# EAGLE design NodeUSB (EAGLE 4.16)
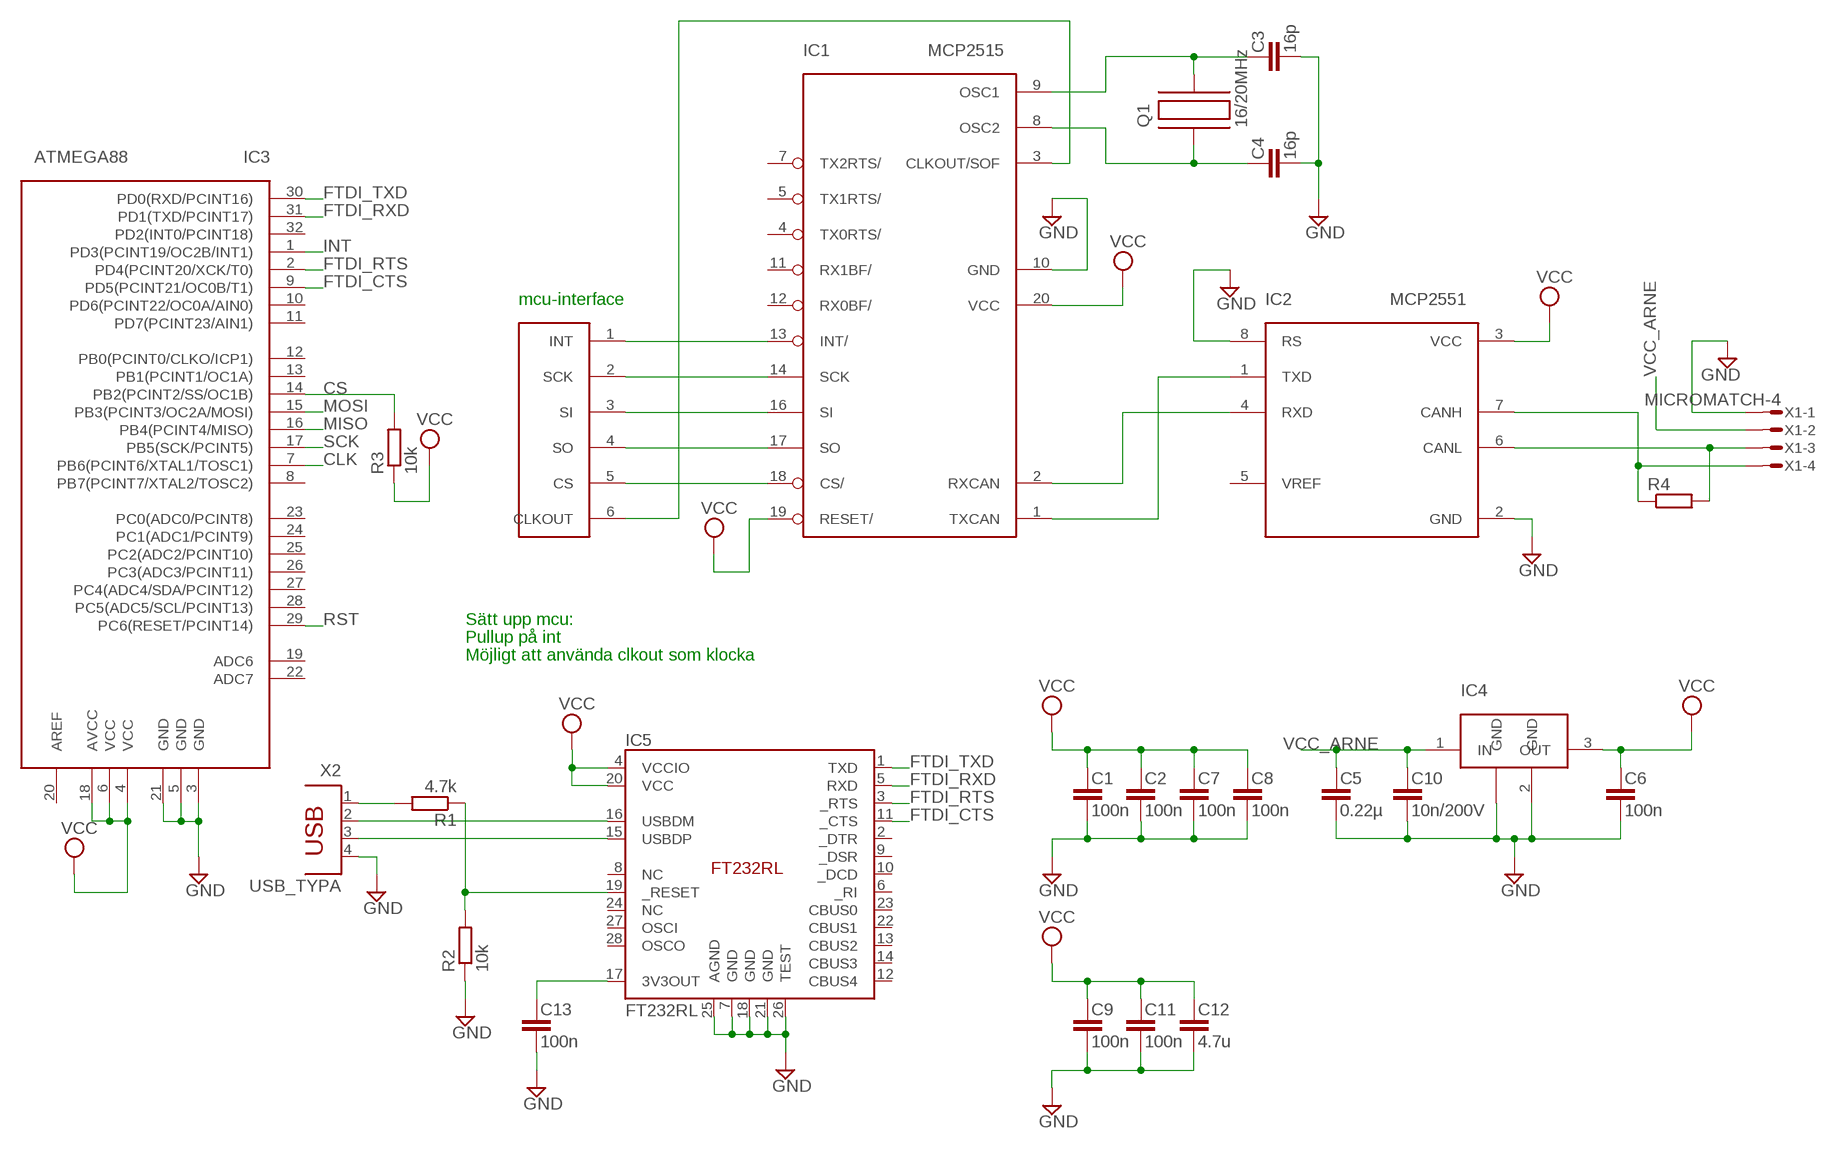
[diagram p0: schematic, sheet 1]

## Parts
C1  100n  C-EU  [C0603]
C2  100n  C-EU  [C0603]
C3  16p  C-EU  [C0603]
C4  16p  C-EU  [C0603]
C5  0.22µ  C-EU  [C0603]
C6  100n  C-EU  [C0603]
C7  100n  C-EU  [C0603]
C8  100n  C-EU  [C0603]
C9  100n  C-EU  [C0603]
C10  10n/200V  C-EU  [C0603]
C11  100n  C-EU  [C0603]
C12  4.7u  C-EU  [C0603]
C13  100n  C-EU  [C0603]
IC1  MCP2515  [TSSOP]
IC2  MCP2551  [SOIC]
IC3  ATMEGA88  [TQFP32]
IC4  LM340MP-5.0  [SOT223]
IC5  FT232RL  [SSOP-28]
Q1  16/20MHz  C-MAC-LFA147E  [SMD]
R1  4.7k  R-EUR0603  [R0603]
R2  10k  R-EUR0603  [R0603]
R3  10k  R-EUR0603  [R0603]
R4  R-EUR0603  [R0603]
U$1  CAN-INTERFACE  [VIA-LIST]
X1  MICROMATCH-4  [MICROMATCH-4]
X2  USB_TYPA  [LUMBERG_TYPA]

## Nets
CANH: IC2.7(CANH) R4.1 X1.4
CANL: IC2.6(CANL) R4.2 X1.3
CLK: IC1.3(CLKOUT/SOF) IC3.7(PB6(PCINT6/XTAL1/TOSC1)) U$1.6(CLKOUT)
CS: IC1.18(CS/) IC3.14(PB2(PCINT2/SS/OC1B)) R3.2 U$1.5(CS)
FTDI_CTS: IC3.9(PD5(PCINT21/OC0B/T1)) IC5.11(_CTS)
FTDI_RTS: IC3.2(PD4(PCINT20/XCK/T0)) IC5.3(_RTS)
FTDI_RXD: IC3.31(PD1(TXD/PCINT17)) IC5.5(RXD)
FTDI_TXD: IC3.30(PD0(RXD/PCINT16)) IC5.1(TXD)
GND: C1.2 C2.2 C3.2 C4.2 C5.2 C6.2 C7.2 C8.2 C9.2 C10.2 C11.2 C12.2 C13.2 IC1.10(GND) IC2.2(GND) IC2.8(RS) IC3.3(GND) IC3.5(GND) IC3.21(GND) IC4.2(GND) IC4.4(GND) IC5.7(GND) IC5.18(GND) IC5.21(GND) IC5.25(AGND) IC5.26(TEST) R2.1 X1.1 X2.4
INT: IC1.13(INT/) IC3.1(PD3(PCINT19/OC2B/INT1)) U$1.1(INT)
MISO: IC1.17(SO) IC3.16(PB4(PCINT4/MISO)) U$1.4(SO)
MOSI: IC1.16(SI) IC3.15(PB3(PCINT3/OC2A/MOSI)) U$1.3(SI)
N$1: IC1.2(RXCAN) IC2.4(RXD)
N$2: IC1.1(TXCAN) IC2.1(TXD)
N$7: C13.1 IC5.17(3V3OUT)
N$10: IC5.16(USBDM) X2.2
N$11: IC5.15(USBDP) X2.3
N$12: C3.1 IC1.9(OSC1) Q1.P$2
N$13: C4.1 IC1.8(OSC2) Q1.P$1
N$15: R1.2 X2.1
N$16: IC5.19(_RESET) R1.1 R2.2
RST: IC3.29(PC6(RESET/PCINT14))
SCK: IC1.14(SCK) IC3.17(PB5(SCK/PCINT5)) U$1.2(SCK)
VCC: C1.1 C2.1 C6.1 C7.1 C8.1 C9.1 C11.1 C12.1 IC1.19(RESET/) IC1.20(VCC) IC2.3(VCC) IC3.4(VCC) IC3.6(VCC) IC3.18(AVCC) IC4.3(OUT) IC5.4(VCCIO) IC5.20(VCC) R3.1
VCC_ARNE: C5.1 C10.1 IC4.1(IN) X1.2
Unconnected: IC1.4(TX0RTS/) IC1.5(TX1RTS/) IC1.7(TX2RTS/) IC1.11(RX1BF/) IC1.12(RX0BF/) IC2.5(VREF) IC3.8(PB7(PCINT7/XTAL2/TOSC2)) IC3.10(PD6(PCINT22/OC0A/AIN0)) IC3.11(PD7(PCINT23/AIN1)) IC3.12(PB0(PCINT0/CLKO/ICP1)) IC3.13(PB1(PCINT1/OC1A)) IC3.19(ADC6) IC3.20(AREF) IC3.22(ADC7) IC3.23(PC0(ADC0/PCINT8)) IC3.24(PC1(ADC1/PCINT9)) IC3.25(PC2(ADC2/PCINT10)) IC3.26(PC3(ADC3/PCINT11)) IC3.27(PC4(ADC4/SDA/PCINT12)) IC3.28(PC5(ADC5/SCL/PCINT13)) IC3.32(PD2(INT0/PCINT18)) IC5.2(_DTR) IC5.6(_RI) IC5.8(NC) IC5.9(_DSR) IC5.10(_DCD) IC5.12(CBUS4) IC5.13(CBUS2) IC5.14(CBUS3) IC5.22(CBUS1) IC5.23(CBUS0) IC5.24(NC) IC5.27(OSCI) IC5.28(OSCO)

## Notes on the sheet
- mcu-interface
- Sätt upp mcu:
- Pullup på int
- Möjligt att använda clkout som klocka

## Library data of the parts
C1-C13 = rcl:C-EU
IC1 = mcp2515:MCP2515
IC2 = mcp2551:MCP2551
IC3 = atmega88:ATMEGA88
IC4 = lm340mp:LM340MP-5.0
IC5 = ftdi4:FT232RL
Q1 = hc49-4h-smx:C-MAC-LFA147E
R1-R4 = rcl:R-EU
U$1 = can-interface:CAN-INTERFACE
X1 = con-amp-micromatch:MICROMATCH-4: MicroMaTch 4 7-215464-4 / 0-215464-4 Drawing Number C-215464 DDEController.pdf
X2 = usba:USB_TYPA

## Board
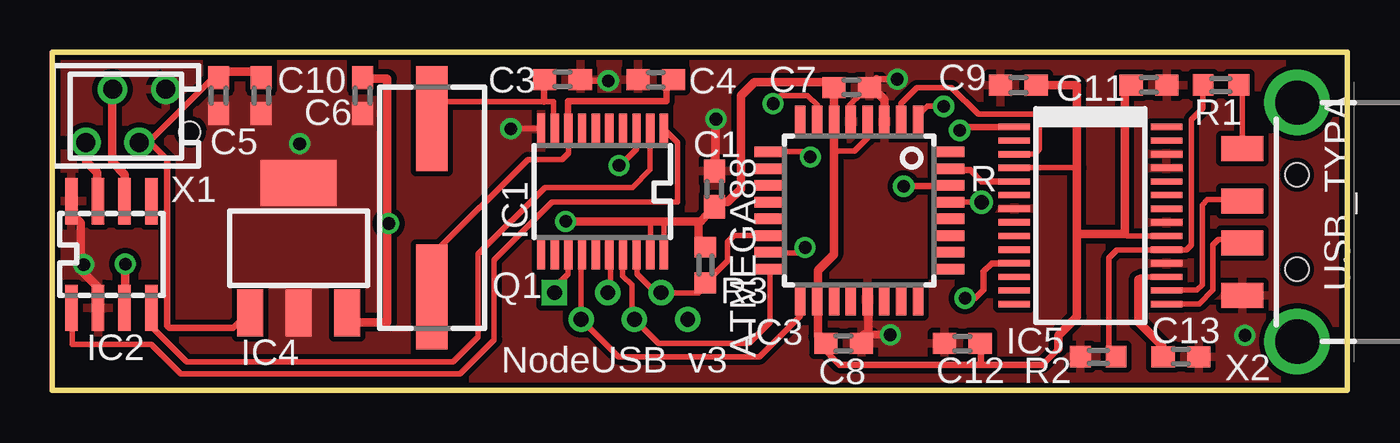
[diagram p1: board, top side]
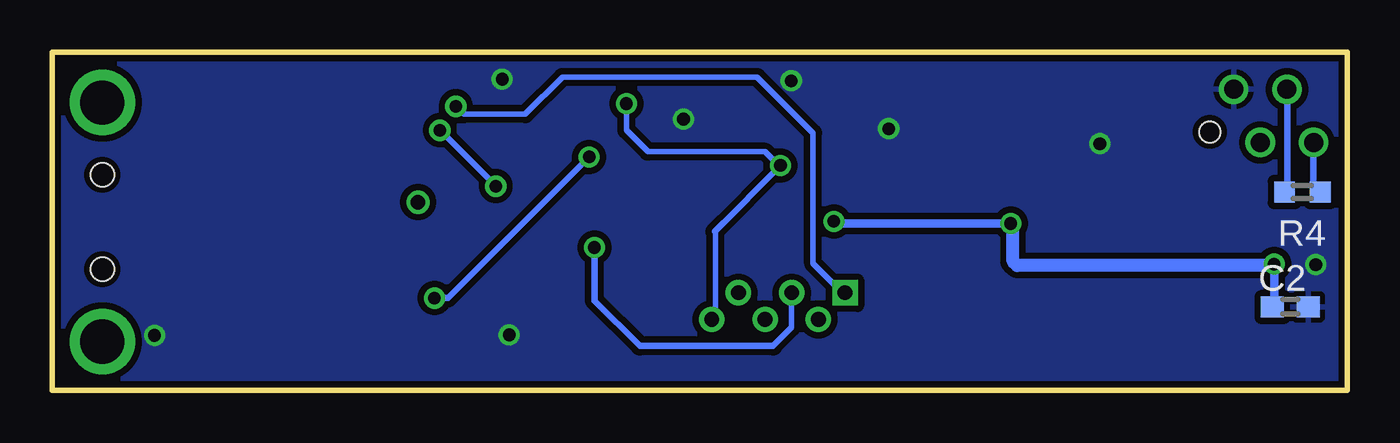
[diagram p2: board, bottom side, seen from below]

Size 61.68 x 16.11 mm. Coordinates in mm from the lower left corner, seen from the top.
Outline: 0,0 61.68,0 61.68,16.11 0,16.11 0,0
Copper layers (1*16): Top 0.035mm / dielectric 1.5mm / Bottom 0.035mm
Design rules "10mils, 0.6drill": minimum track width 10mil, minimum drill 0.6mm, track to track 10mil, track to pad 10mil, pad to pad 10mil, via to via 10mil, smd to smd 10mil, copper to edge 10mil, drill to drill 10mil, minimum pad ring 10mil, minimum via ring 8mil, stop-mask expansion 0mil, vias tented up to drill 0mil, thermal gap 10mil

### Footprints (pad centres in the part's own frame; a part is rotated, then mirrored left to right if it is on the bottom)
C0603 = smd 1.1 x 1: 1 -0.85,0; 2 0.85,0
TSSOP = smd 0.396 x 1.5: 1 -2.925,-2.975; 2 -2.275,-2.975; 3 -1.625,-2.975; 4 -0.975,-2.975; 5 -0.325,-2.975; 6 0.325,-2.975; 7 0.975,-2.975; 8 1.625,-2.975; 9 2.275,-2.975; 10 2.925,-2.975; 11 2.925,2.975; 12 2.275,2.975; 13 1.625,2.975; 14 0.975,2.975; 15 0.325,2.975; 16 -0.325,2.975; 17 -0.975,2.975; 18 -1.625,2.975; 19 -2.275,2.975; 20 -2.925,2.975
SOIC = smd 0.6 x 2.2: 1 -1.905,-2.54; 2 -0.635,-2.54; 3 0.635,-2.54; 4 1.905,-2.54; 5 1.905,2.54; 6 0.635,2.54; 7 -0.635,2.54; 8 -1.905,2.54
TQFP32 = smd 1.5 x 0.5: 1 -4.25,2.65; 2 -4.25,1.85; 3 -4.25,1.05; 4 -4.25,0.25; 5 -4.25,-0.55; 6 -4.25,-1.35; 7 -4.25,-2.15; 8 -4.25,-2.95; 17 4.25,-2.95; 18 4.25,-2.15; 19 4.25,-1.35; 20 4.25,-0.55; 21 4.25,0.25; 22 4.25,1.05; 23 4.25,1.85; 24 4.25,2.65 | smd 0.5 x 1.5: 9 -2.8,-4.4; 10 -2,-4.4; 11 -1.2,-4.4; 12 -0.4,-4.4; 13 0.4,-4.4; 14 1.2,-4.4; 15 2,-4.4; 16 2.8,-4.4; 25 2.8,4.1; 26 2,4.1; 27 1.2,4.1; 28 0.4,4.1; 29 -0.4,4.1; 30 -1.2,4.1; 31 -2,4.1; 32 -2.8,4.1
SOT223 = smd 1.219 x 2.235: 1 -2.311,-3.099; 2 0,-3.099; 3 2.311,-3.099 | smd 3.6 x 2.2: 4 0,3.099
SSOP-28 = smd 0.3 x 1.5: 1 -4.225,-3.625; 2 -3.575,-3.625; 3 -2.925,-3.625; 4 -2.275,-3.625; 5 -1.625,-3.625; 6 -0.975,-3.625; 7 -0.325,-3.625; 8 0.325,-3.625; 9 0.975,-3.625; 10 1.625,-3.625; 11 2.275,-3.625; 12 2.925,-3.625; 13 3.575,-3.625; 14 4.225,-3.625; 15 4.225,3.625; 16 3.575,3.625; 17 2.925,3.625; 18 2.275,3.625; 19 1.625,3.625; 20 0.975,3.625; 21 0.325,3.625; 22 -0.325,3.625; 23 -0.975,3.625; 24 -1.625,3.625; 25 -2.275,3.625; 26 -2.925,3.625; 27 -3.575,3.625; 28 -4.225,3.625
SMD = smd 5 x 1.5: P$1 4.25,0; P$2 -4.25,0
R0603 = smd 0.991 x 1.016: 1 -0.85,0; 2 0.85,0
VIA-LIST = drill 0.7 square: 1 0,2.54 | drill 0.7 round: 2 -1.27,1.27; 3 0,0; 4 -1.27,-1.27; 5 0,-2.54; 6 -1.27,-3.81
MICROMATCH-4 = drill 0.9 round: 1 1.905,1.27; 2 0.635,-1.27; 3 -0.635,1.27; 4 -1.905,-1.27 | hole 1: 3.048,-0.762
LUMBERG_TYPA = smd 1.2 x 2: 1 7,1; 2 4.5,1; 3 2.5,1; 4 0,1 | drill 2.1 round: TAB@1 -2.2,-1.6; TAB@2 9.2,-1.6 | hole 1.1: 1.25,-1.6; 5.75,-1.6

### Placement (x,y rotation side)
C1  31.54,9.6 90 top
C2  2.7,3.97 0 bottom
C3  24.3,14.81 0 top
C4  28.74,14.81 180 top
C5  7.92,14.05 270 top
C6  14.77,14.05 270 top
C7  38.08,14.44 0 top
C8  37.69,2.23 0 top
C9  46.02,14.55 180 top
C10  9.95,14.05 270 top
C11  52.24,14.55 0 top
C12  43.35,2.24 180 top
C13  53.76,1.6 0 top
IC1  26.21,9.48 180 top
IC2  2.8,6.47 0 top
IC3  38.59,8.57 270 top
IC4  11.73,6.78 0 top
IC5  49.45,8.33 270 top
Q1  18.08,8.71 270 top
R1  55.67,14.55 0 top
R2  49.83,1.6 0 top
R3  31.11,5.97 270 top
R4  2.12,9.45 180 bottom
U$1  26.46,4.65 90 top
X1  3.5,13.08 0 top
X2  57.7,4.52 90 top

### Tracks (layer width: path | path; a pad name or v marks a point on that pad's centre or on a via)
CANH
  Top 0.305: 2.12,9.06 IC2.7 | X1.4 1.62,11.81
  Top 0.406: 2.12,9.06 2.12,10.39 1.62,10.9 1.62,11.81
  Bottom 0.305: X1.4 1.62,11.81 1.62,9.79 R4.1
CANL
  Top 0.305: IC2.6 | X1.3 2.84,14.35
  Top 0.406: IC2.6 3.45,10.29 2.84,10.9 2.84,14.35
  Bottom 0.305: X1.3 2.84,14.35 2.84,9.59 R4.2
CLK  (via drill 0.6)
  Top 0.254: IC1.3 27.83,12.34 27.83,11.51 27.02,10.69 v26.99,10.72 | 30.22,3.33 30.17,3.38 | IC3.7 36.44,13.59 35.98,14.05 34.71,14.05 v34.33,13.67
  Top 0.406: 30.17,3.28 30.22,3.33 U$1.6
  Bottom 0.254: 30.09,7.57 30.09,3.53 U$1.6 | 30.09,7.57 30.09,7.59 v26.99,10.72 27.07,10.72 27.73,11.38 33.32,11.38 34.33,12.4 v34.33,13.67 | 30.09,7.57 30.14,7.57 29.71,8 29.68,8
CS
  Top 0.254: IC1.18 27.83,6.63 27.86,6.63 27.86,5.54 28.87,4.52 U$1.5 30.78,4.65 31.03,4.9 31.03,5.11 30.97,5.11 R3.2 32.17,6.17 32.17,7.06 32.48,7.37 IC3.14
FTDI_CTS  (via drill 0.6)
  Top 0.254: IC3.9 35.86,11.38 v36.11,11.13
  Top 0.305: v43.48,4.4 43.98,4.4 44.37,4.78 44.37,5.66 44.76,6.06 45.77,6.06 IC5.11
  Bottom 0.305: v36.11,11.13 42.84,4.4 v43.48,4.4
FTDI_RTS
  Top 0.254: IC5.3 46.78,11.26 47.03,11.51 47.03,12.9 46.78,13.16 44.11,13.16 42.84,14.43 41.19,14.43 40.43,13.67 40.43,12.9 40.44,12.9 IC3.2
FTDI_RXD
  Top 0.254: IC5.5 45.79,9.96 | IC3.31 42.69,10.59 42.71,10.62 42.84,10.49
  Top 0.305: 45.79,9.96 44.26,9.96 43.73,10.49 42.84,10.49
FTDI_TXD  (via drill 0.6)
  Top 0.254: IC5.1 45.67,12.56 45.64,12.56 | v43.22,12.4 43.1,12.56 | 42.59,9.73 42.63,9.77 IC3.30
  Top 0.305: 43.1,12.56 45.64,12.56 | v40.55,9.73 42.59,9.73
  Bottom 0.305: v40.55,9.73 v43.22,12.4
GND  (via drill 0.6)
  Top 0.254: v21.84,12.47 23.28,12.47 IC1.10 | C1.2 31.59,10.77 | 1.34,5.74 v1.49,5.99 | 38.88,3.84 IC3.21 38.85,4.55 | C8.2 38.88,2.69 | C7.2 38.6,14.38 38.6,14.2 37.96,13.59 38.02,13.03 38.04,13.01 IC3.5 | v31.61,12.93 31.44,12.88 31.59,12.73
  Top 0.305: IC2.2 2.2,4.27 | C3.2 25.32,14.76 v26.48,14.76 | 38.6,14.2 38.6,14.43 38.62,14.45 39.26,14.83 v40.25,14.83
  Top 0.406: 2.2,4.27 2.2,4.88 1.34,5.74 1.34,7.98 0.83,8.48 IC2.8 | 38.88,2.69 38.88,3.84 | 31.59,10.77 31.59,12.73 | 39.26,14.83 39.13,14.35 39.64,13.85 IC3.3 | C8.2 38.67,2.66 v39.92,2.64
  Bottom 0.305: v26.48,14.76 26.43,14.71 | v40.25,14.83 40.12,14.58
  Bottom 0.406: v39.92,2.64 39.67,2.62
  other vias: 11.78,11.76 56.81,2.62
  pour Bottom (isolate 0.305): 0.12,16 61.65,16 61.65,0.1 24.38,0.1 0.12,0.1
  pour Top (isolate 0.305, no thermals): 5.83,15.38 15.89,15.38 15.89,1.67 5.83,1.67
  pour Top (isolate 0.254): 0.17,15.95 61.51,15.95 61.51,0.08 0.17,0.08
INT  (via drill 0.6)
  Top 0.254: IC1.13 | IC1.13 | U$1.1 23.92,4.9 24.55,5.54 24.55,6.48 IC1.13 | IC3.1 41.24,12.98 41.19,13.03 41.7,13.54 v42.46,13.54
  Bottom 0.254: v42.46,13.54 42.08,13.16 39.16,13.16 37.38,14.94 28.11,14.94 25.44,12.27 25.44,6.05 23.92,4.52 U$1.1
MISO
  Top 0.254: IC1.17 27.18,6.57 27.17,6.55 27.17,5.46 27.6,5.03 27.6,3.63 27.73,3.51 U$1.4 28.87,2.24 33.19,2.24 34.19,3.23 IC3.16
MOSI  (via drill 0.6)
  Top 0.254: IC1.16 26.53,6.63 26.51,6.6 26.51,6.38 26.58,6.3 26.58,4.78 U$1.3 | 34.26,6.53 34.21,6.57 IC3.15 34.31,6.57 34.33,6.55 35.6,6.55 v35.86,6.81
  Bottom 0.254: U$1.3 26.51,4.7 | U$1.3 26.41,4.6 | 27.35,2.11 26.46,3 26.46,4.52 26.33,4.65 U$1.3
  Bottom 0.305: v35.86,6.81 35.86,4.27 33.7,2.11 27.35,2.11
N$1
  Top 0.254: 4.77,3.89 4.75,3.89 IC2.4 4.71,3.92 4.74,3.89 4.74,3 6.39,1.35 19.09,1.35 20.29,2.54 20.29,6.5 23.46,9.68 27.63,9.68 28.48,10.53 IC1.2
N$2
  Top 0.254: IC1.1 29.79,11.8 29.79,8.97 23.79,8.97 21.05,6.22 21.05,2.41 19.42,0.79 6.11,0.79 4.72,2.19 0.93,2.19 0.93,3.51 IC2.1 | IC2.1 0.91,3.99 | IC2.1
N$7
  Top 0.254: 51.73,5.28 51.86,5.41 52.87,5.41 52.88,5.41 IC5.17
  Top 0.406: 51.73,5.28 51.73,3.25 52.87,2.11 C13.1
N$10
  Top 0.254: IC5.16 53.09,4.78 54.53,4.78 54.78,5.03 54.78,8.84 55.03,9.09 56.43,9.09 56.61,9.28 X2.2
N$11
  Top 0.254: IC5.15 53.09,4.11 53.11,4.12 54.63,4.12 55.29,4.78 55.29,6.94 55.54,7.19 56.68,7.19 56.7,7.2 X2.3
N$12
  Top 0.254: IC1.9 23.87,12.8 23.87,13.77 23.41,13.77 18.13,13.77 Q1.P$2
  Top 0.305: C3.1 23.41,14.34 23.41,13.77
N$13
  Top 0.254: Q1.P$1 18.14,6.49 22.65,11 24.27,11 24.58,11.3 24.58,12.22 24.55,12.24 24.55,12.33
  Top 0.305: IC1.8 24.55,12.33 24.55,13.79 29.25,13.79 29.25,14.85 C4.1
N$15
  Top 0.254: R1.2 56.52,14.47 56.7,14.28 X2.1
N$16
  Top 0.254: R2.2 50.8,1.64 50.33,1.73 50.33,6.3 50.72,6.68 53,6.68 53.03,6.71 IC5.19 53.1,6.71 53.13,6.68 54.02,6.68 54.27,6.94 54.27,12.9 54.82,13.45 R1.1
RST  (via drill 0.7)
  Top 0.254: 42.71,8.97 v44.26,8.97
  Top 0.406: IC3.29 42.71,8.97
SCK
  Top 0.254: IC1.14 25.23,6.6 25.19,6.55 IC1.14 25.19,6.5 U$1.2 26.97,1.6 33.7,1.6 35.64,3.54 IC3.17
VCC  (via drill 0.6)
  Top 0.254: 37.23,13.08 IC3.6 37.23,12.32 | 36.47,4.55 IC3.18 | IC1.20 29.12,6.63 29.12,8.05 29.68,8.05 | IC1.19 28.48,6.56 28.49,6.55 28.49,8.05 28.49,8.08 | 30.57,8.1 30.78,8.1 30.9,8.08 | IC3.4 38.84,12.02 38.22,11.41 37.23,11.41 | R3.1 30.78,6.82 30.78,7.95 31.79,8.97 | IC5.4 45.88,10.61 45.89,10.62 48.81,10.62 | IC5.20 53.04,7.36 52.98,7.36 51.2,7.36 51.1,7.44
  Top 0.305: 47.92,1.98 47.16,1.22 44.24,1.22 | 44.24,1.22 37.51,1.22 36.59,2.14 | 44.24,1.22 44.24,2.49
  Top 0.406: 15.95,7.95 15.95,3.24 14.08,3.24 14.08,3.94 IC4.3 | IC2.3 3.42,4.32 3.47,4.8 v3.47,6.02 | 15.95,7.95 15.95,14.86 14.83,14.86 14.77,14.81 C6.1 | v16.02,7.95 15.95,7.95 | v24.45,8.05 28.49,8.05 29.68,8.05 | 29.68,8.05 | IC3.18 36.47,3.84 36.47,2.57 C8.1 36.59,2.14 | 37.13,14.68 C7.1 | 37.23,13.08 37.23,13.97 C7.1 | 36.47,4.55 36.47,5.72 37.23,6.48 37.23,11.41 37.23,12.32 | 29.68,8.05 30.78,8.05 | 30.78,8.05 30.9,8.05 30.9,8.08 C1.1 | R3.1 30.88,6.84 30.88,6.94 30.78,7.04 30.78,7.95 30.78,8.05 | 31.79,8.97 32.17,8.97 32.81,9.6 32.81,14.05 33.44,14.68 37.13,14.68 | C7.1 37.23,14.53 37.25,14.55 37.13,14.68 | C9.1 48.81,14.55 48.81,10.62 48.81,7.44 | 47.92,1.98 47.92,2.62 48.81,3.51 48.81,7.44 | C11.1 51.39,14.47 51.1,14.43 51.1,7.44 48.81,7.44 | C12.1 44.2,2.53 44.24,2.49
  Bottom 0.254: C2.1 3.47,4.47
  Bottom 0.406: 3.47,4.47 3.47,5.94 v3.47,6.02 | v24.45,8.05 24.4,8.05 24.3,7.95 v16.02,7.95
  Bottom 0.61: 3.47,5.94 15.71,5.94 15.92,6.15 15.92,7.95 v16.02,7.95
VCC_ARNE
  Top 0.254: 7.88,14.86 C5.1
  Top 0.305: IC4.1 9.31,3.68 8.61,2.97 5.58,2.97 5.48,3.07 5.48,11 4.67,11.81 4.26,11.81 | 7.88,14.86 7.61,14.86 4.56,11.81 4.26,11.81 | 4.26,11.81 X1.2
  Top 0.406: C10.1 9.95,15.19 7.92,15.19 C5.1

### Text on the board
tPlace: R | NodeUSB | v3